# EAGLE design pycom_weather_station_pcb (EAGLE 9.6.2)
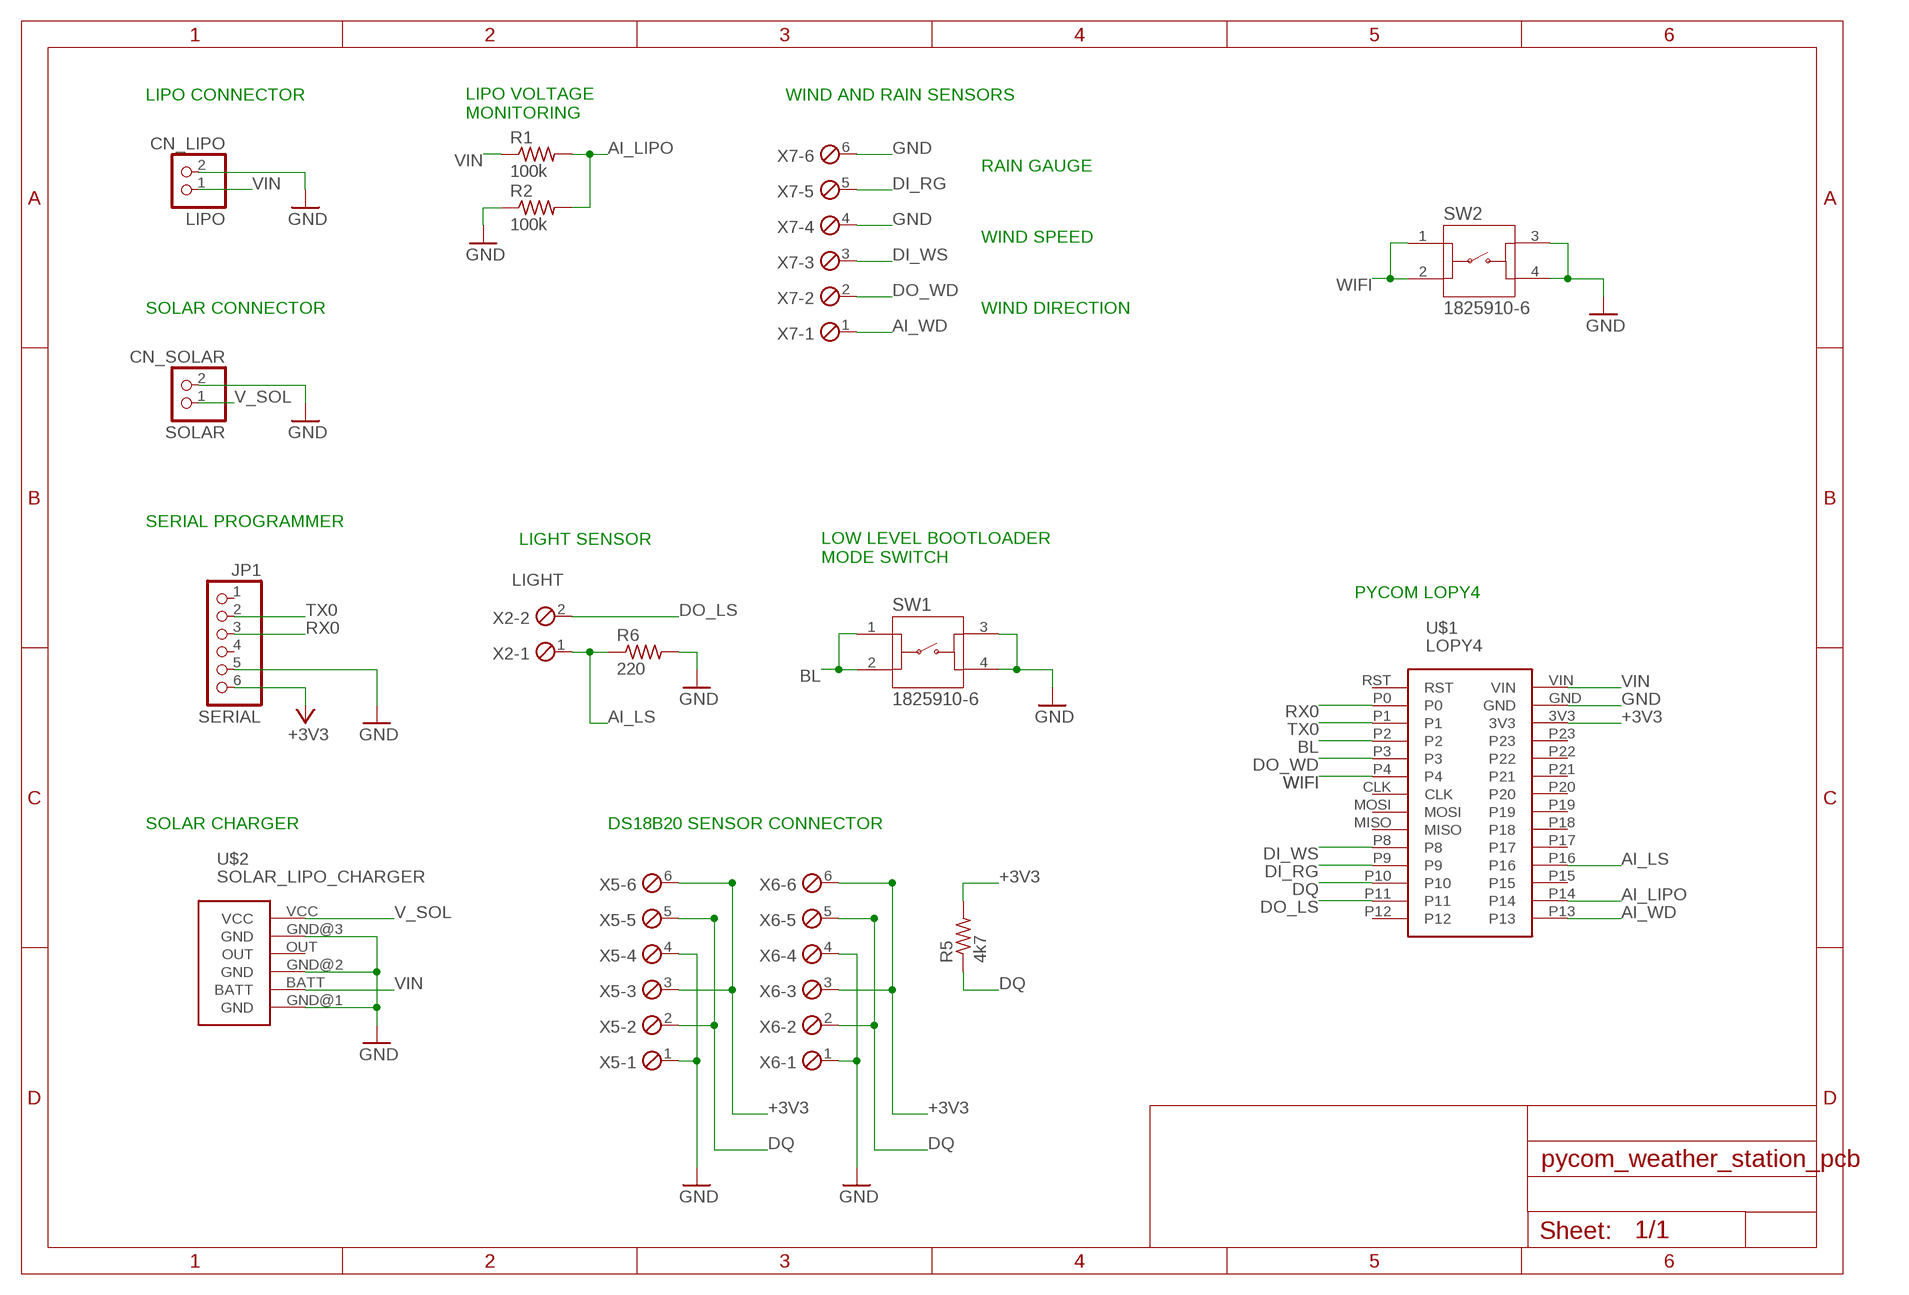
[diagram p0: schematic, sheet 1]

## Parts
CN_LIPO  LIPO  JST_2PIN-THM  [JST-PH-2-THM]
CN_SOLAR  SOLAR  JST_2PIN-THM  [JST-PH-2-THM]
JP1  SERIAL  PINHD-1X6CB  [1X06-CLEANBIG]
R1  100k  R-US_0204/7  [0204/7]
R2  100k  R-US_0204/7  [0204/7]
R5  4k7  R-US_0204/7  [0204/7]
R6  220  R-US_0204/7  [0204/7]
SW1  1825910-6  [SW_1825910-6-4]
SW2  1825910-6  [SW_1825910-6-4]
U$1  LOPY4  [LOPY4]
U$2  SOLAR_LIPO_CHARGER  [SOLAR_LIPO_CHARGER]
X2  LIGHT  MPT2  [2POL254]
X5  MPT6  [6POL254]
X6  MPT6  [6POL254]
X7  MPT6  [6POL254]

## Nets
+3V3: JP1.6 R5.2 U$1.3V3 X5.3 X5.6 X6.3 X6.6
AI_LIPO: R1.2 R2.2 U$1.P14
AI_LS: R6.1 U$1.P16 X2.1
AI_WD: U$1.P13 X7.1
BL: SW1.1 SW1.2 U$1.P2
DI_RG: U$1.P9 X7.5
DI_WS: U$1.P8 X7.3
DO_LS: U$1.P11 X2.2
DO_WD: U$1.P3 X7.2
DQ: R5.1 U$1.P10 X5.2 X5.5 X6.2 X6.5
GND [power]: CN_LIPO.2 CN_SOLAR.2 JP1.5 R2.1 R6.2 SW1.3 SW1.4 SW2.3 SW2.4 U$1.GND U$2.GND@1(GND) U$2.GND@2(GND) U$2.GND@3(GND) X5.1 X5.4 X6.1 X6.4 X7.4 X7.6
RX0: JP1.3 U$1.P0
TX0: JP1.2 U$1.P1
V_SOL [power]: CN_SOLAR.1 U$2.VCC
VIN [power]: CN_LIPO.1 R1.1 U$1.VIN U$2.BATT
WIFI: SW2.1 SW2.2 U$1.P4
Unconnected: JP1.1 JP1.4 U$1.CLK U$1.MISO U$1.MOSI U$1.P12 U$1.P15 U$1.P17 U$1.P18 U$1.P19 U$1.P20 U$1.P21 U$1.P22 U$1.P23 U$1.RST U$2.OUT

## Notes on the sheet
- LIPO CONNECTOR | WIND AND RAIN SENSORS
- LIPO VOLTAGE
  MONITORING
- RAIN GAUGE
- WIND SPEED
- SOLAR CONNECTOR | WIND DIRECTION
- SERIAL PROGRAMMER
- LIGHT SENSOR
- LOW LEVEL BOOTLOADER
  MODE SWITCH
- PYCOM LOPY4
- SOLAR CHARGER | DS18B20 SENSOR CONNECTOR

## Library data of the parts
CN_LIPO CN_SOLAR = adafruit:JST_2PIN: JST 2-Pin Connectors of various flavors SMT-RA (S2B-PH-SM4) 4UConnector #17311 SMT (B2B-PH-SM4) THM-RA (S2B-PH) THM (B2B-PH)
JP1 = adafruit_components:PINHD-1X6: PIN HEADER
R1 R2 R5 R6 = rcl:R-US_: RESISTOR, American symbol; SPICEPREFIX: R
SW1 SW2 = 1825910-6:1825910-6: Switch Tactile OFF (ON) SPST Round Button PC Pins 0.05A 24VDC 100000Cycles 1.57N Thru-Hole Loose; MANUFACTURER: TE CONNECTIVITY; PARTREV: C10; STANDARD: Manufacturer Recommendations
U$1 = pycom_components:LOPY4: Pycom LoPy4; DATASHEET: https://docs.pycom.io/gitbook/assets/specsheets/Pycom_002_Specsheets_LoPy4_v2.pdf
U$2 = adafruit_components:SOLAR_LIPO_CHARGER; DATASHEET: https://www.adafruit.com/product/390
X2 = con-phoenix-254:MPT2: PHOENIX CONNECTOR; OC_FARNELL: unknown; OC_NEWARK: unknown
X5-X7 = con-phoenix-254:MPT6: PHOENIX CONNECTOR; OC_FARNELL: unknown; OC_NEWARK: unknown

## Net classes
0 default: width 0.406 mm, drill 0.6 mm, clearance 0.406 mm
1 power: width 0.813 mm, drill 0.6 mm, clearance 0.508 mm

## Board
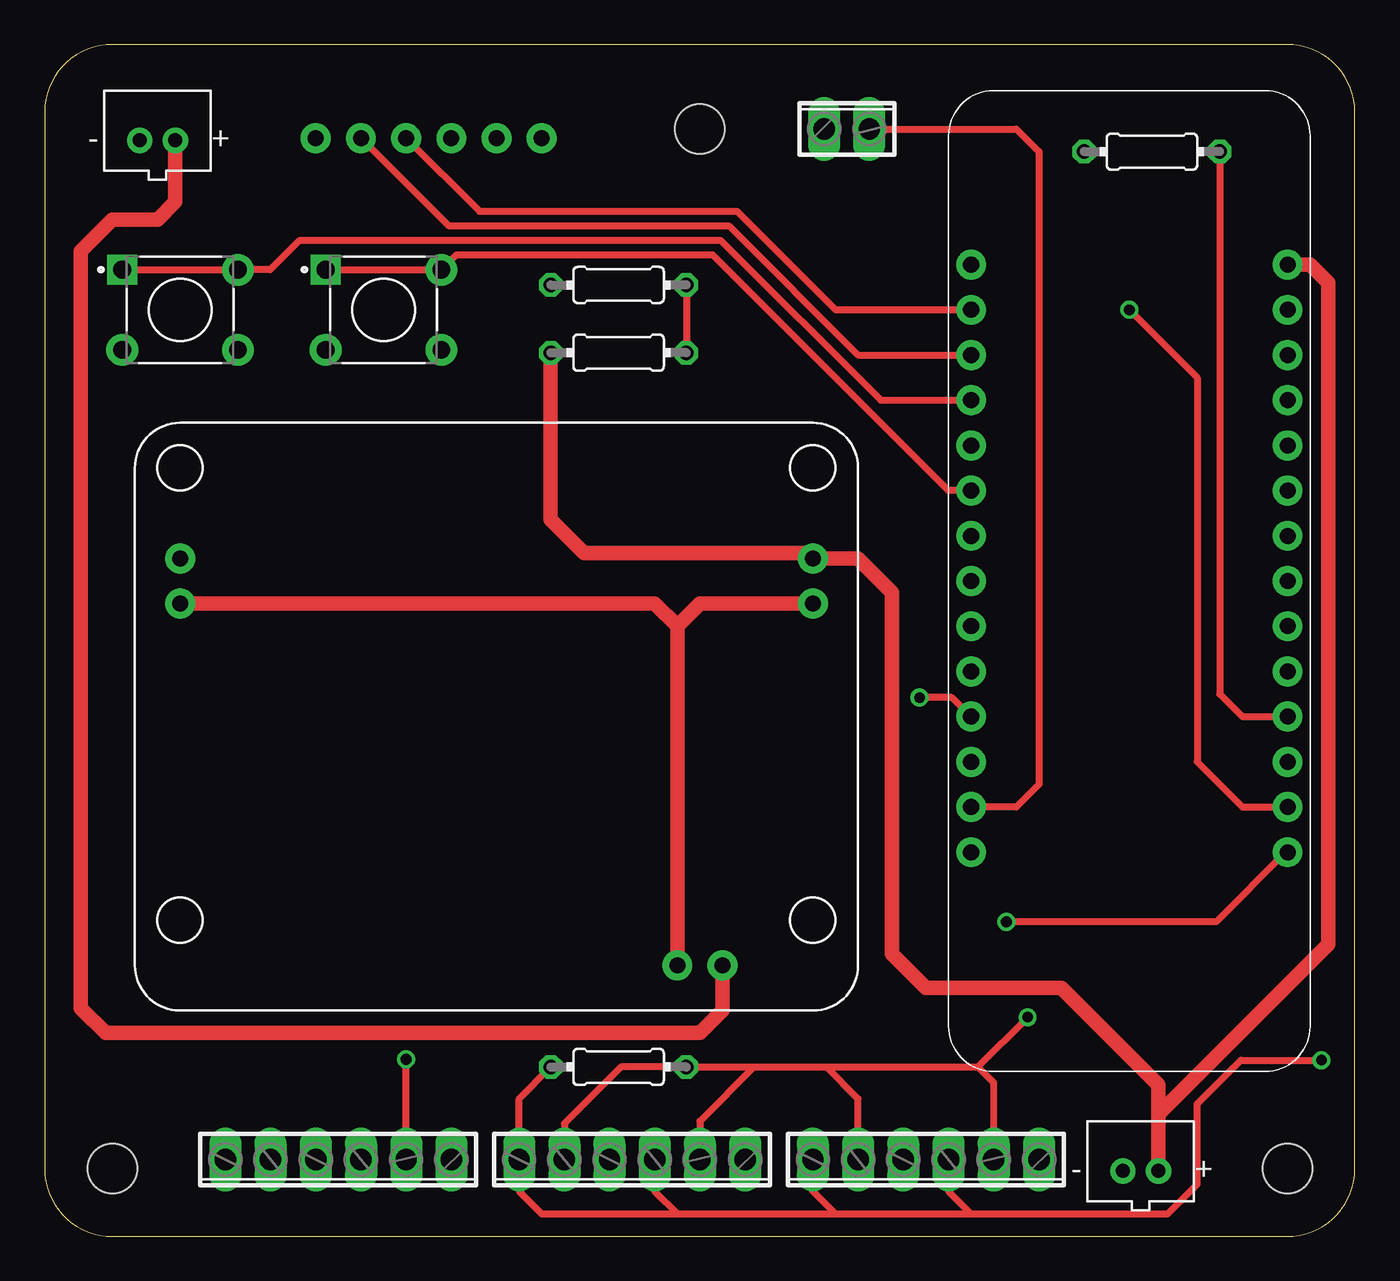
[diagram p1: board, top side]
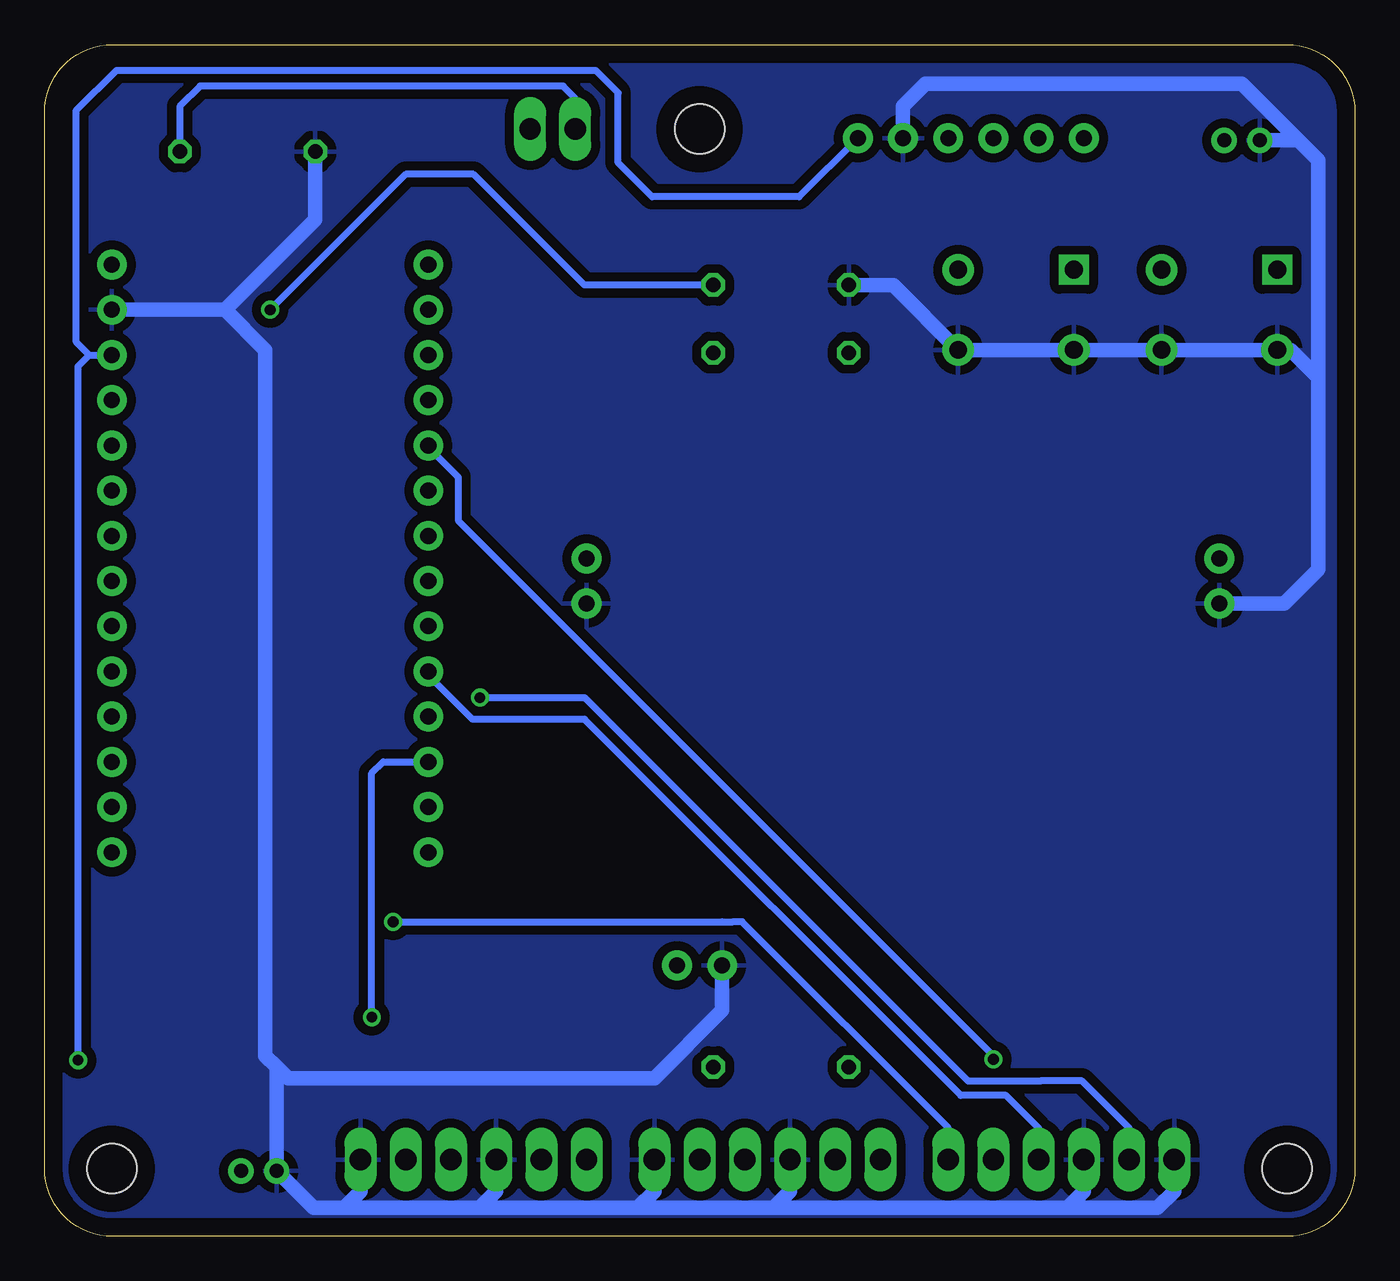
[diagram p2: board, bottom side, seen from below]

Size 73.64 x 66.98 mm. Coordinates in mm from the lower left corner, seen from the top.
Outline: 73.64,3.81 73.64,63.17 arc90 69.83,66.98 3.81,66.98 arc90 0,63.17 0,3.81 arc90 3.81,0 69.83,0 arc90 73.64,3.81
Copper layers (1*16): Top 0.035mm / dielectric 1.5mm / Bottom 0.035mm
Design rules "PCBway *": minimum track width 6mil, minimum drill 0.3mm, track to track 0.205mm, track to pad 0.205mm, pad to pad 0.205mm, via to via 0.205mm, smd to smd 8mil, copper to edge 40mil, drill to drill 8mil, minimum pad ring 10mil, minimum via ring 8mil, stop-mask expansion 4mil, vias tented up to drill 25mil, thermal gap 20mil
Holes 2.8 mm at 3.81,3.81 69.85,3.81 36.83,62.23

### Footprints (pad centres in the part's own frame; a part is rotated, then mirrored left to right if it is on the bottom)
JST-PH-2-THM = drill 0.8 pad 1.422: 1 1,0; 2 -1,0
1X06-CLEANBIG = drill 0.9 pad 1.676: 1 -6.35,0; 2 -3.81,0; 3 -1.27,0; 4 1.27,0; 5 3.81,0; 6 6.35,0
0204/7 = drill 0.813 octagon: 1 -3.81,0; 2 3.81,0
SW_1825910-6-4 = drill 1 pad 1.676 square: 1 -3.25,2.25 | drill 1 pad 1.778: 2 3.25,2.25; 3 -3.25,-2.25; 4 3.25,-2.25
LOPY4 = drill 0.9 pad 1.676: 3V3 -11.43,8.89; CLK -1.27,-8.89; GND -13.97,8.89; MISO 3.81,-8.89; MOSI 1.27,-8.89; P0 -13.97,-8.89; P1 -11.43,-8.89; P2 -8.89,-8.89; P3 -6.35,-8.89; P4 -3.81,-8.89; P8 6.35,-8.89; P9 8.89,-8.89; P10 11.43,-8.89; P11 13.97,-8.89; P12 16.51,-8.89; P13 16.51,8.89; P14 13.97,8.89; P15 11.43,8.89; P16 8.89,8.89; P17 6.35,8.89; P18 3.81,8.89; P19 1.27,8.89; P20 -1.27,8.89; P21 -3.81,8.89; P22 -6.35,8.89; P23 -8.89,8.89; RST -16.51,-8.89; VIN -16.51,8.89
SOLAR_LIPO_CHARGER = drill 0.9 pad 1.676: BATT 0,0; GND@1 0,2.54; GND@2 35.56,2.54; GND@3 7.62,22.86; OUT 35.56,0; VCC 5.08,22.86
2POL254 = drill 1.2 long: 1 -1.27,0; 2 1.27,0
6POL254 = drill 1.2 pad 1.778 long: 1 -6.35,0; 2 -3.81,0; 3 -1.27,0; 4 1.27,0; 5 3.81,0; 6 6.35,0

### Placement (x,y rotation side)
CN_LIPO  61.59,3.68 0 top
CN_SOLAR  6.35,61.59 0 top
JP1  21.59,61.72 0 top
R1  32.26,49.66 0 top
R2  32.26,53.47 0 top
R5  32.26,9.53 180 top
R6  62.23,60.96 180 top
SW1  7.62,52.07 0 top
SW2  19.05,52.07 0 top
U$1  60.96,38.1 270 top
U$2  43.18,38.1 180 top
X2  45.09,62.23 0 top
X5  33.02,4.32 180 top
X6  49.53,4.32 180 top
X7  16.51,4.32 180 top

### Tracks (layer width: path | path; a pad name or v marks a point on that pad's centre or on a via)
+3V3  (via drill 0.6)
  Top 0.406: 44.45,1.27 52.07,1.27 | 44.45,1.27 43.18,2.54 X6.6 | 52.07,1.27 50.8,2.54 X6.3 | 52.07,1.27 63.11,1.27 64.77,2.93 64.77,7.45 67.22,9.91 v71.75,9.91 | 35.56,1.27 27.94,1.27 26.67,2.54 X5.6 26.67,7.75 R5.2 | 35.56,1.27 44.45,1.27 | X5.3 34.29,2.54 35.56,1.27
  Bottom 0.406: v71.75,9.91 71.75,48.9 71.12,49.53 | 71.12,49.53 U$1.3V3 | 71.12,49.53 71.88,50.29 71.88,63.25 69.6,65.53 42.67,65.53 41.4,64.26 41.4,60.33 39.5,58.42 31.24,58.42 JP1.6
AI_LIPO  (via drill 0.6)
  Top 0.406: R2.2 R1.2 | U$1.P14 67.31,24.13 64.77,26.67 64.77,48.26 v60.96,52.07
  Bottom 0.406: R2.2 43.31,53.47 49.53,59.69 53.34,59.69 v60.96,52.07
AI_LS
  Top 0.406: R6.1 66.04,30.48 67.31,29.21 U$1.P16
  Bottom 0.406: X2.1 43.81,63.96 44.5,64.64 64.9,64.64 66.04,63.5 R6.1
AI_WD  (via drill 0.6)
  Top 0.406: v54.05,17.68 65.84,17.68 69.7,21.54 U$1.P13
  Bottom 0.406: v54.05,17.68 35.56,17.68 34.95,17.68 34.44,17.68 22.86,6.1 X7.1
BL
  Top 0.406: SW1.1 SW1.2 12.68,54.32 14.34,55.98 38,55.98 46.99,46.99 U$1.P2 52.02,47.14
DI_RG  (via drill 0.6)
  Top 0.406: v49.17,30.28 51,30.28 U$1.P9
  Bottom 0.406: v49.17,30.28 43.28,30.28 21.74,8.74 17.78,8.74 17.68,8.74 15.34,8.74 12.7,6.1 X7.5
DI_WS
  Bottom 0.406: U$1.P8 52.22,31.7 49.58,29.06 43.28,29.06 22.15,7.92 19.61,7.92 17.78,6.1 X7.3
DO_LS
  Top 0.406: X2.2 54.61,62.23 55.88,60.96 55.88,25.4 54.61,24.13 U$1.P11
DO_WD  (via drill 0.6)
  Top 0.406: X7.2 v20.32,9.96
  Bottom 0.406: v20.32,9.96 20.32,10.16 50.39,40.23 50.39,42.67 52.02,44.3 U$1.P3
DQ  (via drill 0.6)
  Top 0.406: R5.1 36.2,9.4 | R5.1 32.38,9.53 29.21,6.35 X5.5 | R5.1 39.88,9.53 | 52.45,9.53 v55.24,12.32 | X5.2 36.83,6.48 39.88,9.53 | X6.5 45.72,7.75 43.94,9.53 | 39.88,9.53 43.94,9.53 | 43.94,9.53 52.45,9.53 | 52.45,9.53 53.34,8.64 X6.2
  Bottom 0.406: v55.24,12.32 55.24,26.04 54.61,26.67 U$1.P10
GND
  Top 0.813: U$2.GND@3 35.56,34.29 | 35.56,34.29 36.83,35.56 U$2.GND@1 | 35.56,34.29 34.29,35.56 U$2.GND@2
  Bottom 0.813: 63.5,52.07 U$1.GND | U$2.GND@2 3.96,35.56 2.06,37.47 2.06,48.26 | 2.06,48.26 2.06,60.48 3.17,61.59 | 3.17,61.59 CN_SOLAR.2 | 60.59,9.53 CN_LIPO.2 58.52,1.6 56.82,1.6 | 63.5,52.07 61.23,49.8 61.23,10.16 60.59,9.53 | 35.56,13.97 U$2.GND@3 35.56,12.7 39.37,8.89 59.96,8.89 60.59,9.53 | 16.18,1.6 32.69,1.6 | 32.69,1.6 40.31,1.6 | 40.31,1.6 49.2,1.6 | 49.2,1.6 56.82,1.6 | 55.88,2.54 56.82,1.6 | 48.26,2.54 49.2,1.6 | 10.16,2.54 11.1,1.6 16.18,1.6 | 63.5,52.07 58.42,57.15 R6.2 | 3.17,61.59 6.35,64.77 24.13,64.77 25.4,63.5 JP1.5 | SW2.3 SW2.4 25.95,53.47 R2.1 | SW2.3 15.65,49.82 | 15.65,49.82 10.97,49.82 | 10.97,49.82 SW1.4 | SW1.4 SW1.3 3.62,49.82 2.06,48.26 | SW1.4 10.97,49.78 10.97,49.82 | 15.65,49.82 15.65,49.99 SW2.3 | X7.4 15.24,2.54 16.18,1.6 | X5.4 31.75,2.54 32.69,1.6 | X5.1 39.37,2.54 40.31,1.6
  pour Bottom: 0,63.17 0,3.81 arc90 3.81,0 69.83,0 arc90 73.64,3.81 73.64,63.17 arc90 69.83,66.98 3.81,66.98 arc90
RX0
  Top 0.406: JP1.3 24.43,57.61 38.91,57.61 44.45,52.07 U$1.P0
TX0
  Top 0.406: JP1.2 22.71,56.79 38.46,56.79 45.72,49.53 U$1.P1
V_SOL
  Top 0.813: CN_SOLAR.1 7.35,58.15 6.35,57.15 3.81,57.15 2.03,55.37 2.03,12.83 3.43,11.43 36.83,11.43 38.1,12.7 U$2.VCC
VIN
  Top 0.813: U$1.VIN 71.12,54.61 72.14,53.59 72.14,16.4 62.59,6.86 CN_LIPO.1 62.59,8.53 57.15,13.97 49.53,13.97 47.62,15.88 47.62,36.2 45.72,38.1 U$2.BATT 42.98,38.41 30.33,38.41 28.45,40.28 R1.1
WIFI
  Top 0.406: SW2.1 SW2.2 23.15,55.17 37.54,55.17 50.8,41.91 U$1.P4

### Text on the board
tValues: PYCOM | NC | TX0 | RX0 | NC | GND | 3V3 | SOLAR | BOOT LOADER | WIFI ON/OFF | CAPTIF ROAD RESEARCH / TEMPERATURE LOGGER / V0.1 | LIPO | RAIN / GAUGE | WIND / SPEED | WIND / DIRECTION | TEMPERATURE | TEMPERATURE | RED | GRN | RED | BLK | YLW | GRN | 3V3 | DQ | GND | 3V3 | DQ | GND | 3V3 | DQ | GND | 3V3 | DQ | GND